# Altium schematic sheet 03_Part-1.SchDoc
size A3; SheetNumber: 3; SheetTotal: 5
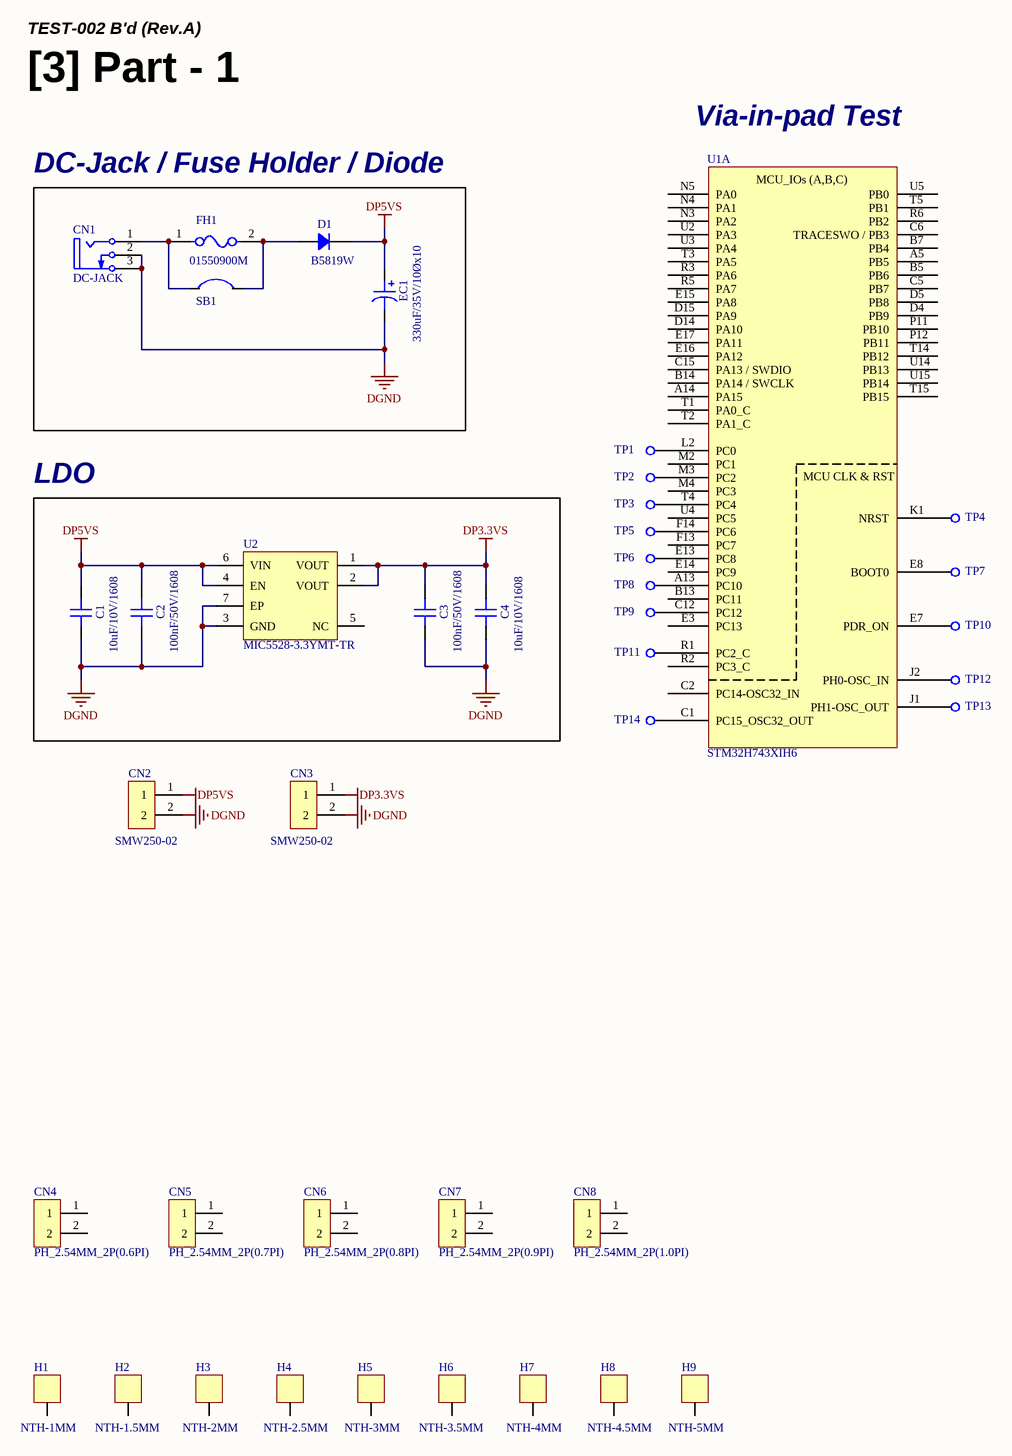
[diagram p0: 03_Part-1.SchDoc]

## Parts
C1  10uF/10V/1608  [CAP 1608 (0603_INCH)]
C2  100nF/50V/1608  [CAP 1608 (0603_INCH)]
C3  100nF/50V/1608  [CAP 1608 (0603_INCH)]
C4  10uF/10V/1608  [CAP 1608 (0603_INCH)]
CN1  DC-JACK  [DUT_CON_DC-JACK]
CN2  SMW250-02  [CON_SMW250-02]
CN3  SMW250-02  [CON_SMW250-02]
CN4  PH_2.54MM_2P(0.6PI)  [DUT_CON_PIN_HEADER-2PIN(2.54MM)_0.6PI]
CN5  PH_2.54MM_2P(0.7PI)  [DUT_CON_PIN_HEADER-2PIN(2.54MM)_0.7PI]
CN6  PH_2.54MM_2P(0.8PI)  [DUT_CON_PIN_HEADER-2PIN(2.54MM)_0.8PI]
CN7  PH_2.54MM_2P(0.9PI)  [DUT_CON_PIN_HEADER-2PIN(2.54MM)_0.9PI]
CN8  PH_2.54MM_2P(1.0PI)  [DUT_CON_PIN_HEADER-2PIN(2.54MM)_1.0PI]
D1  B5819W  [DIO_SOD-123]
EC1  330uF/35V/10Øx10  [CAP_EC_D10.3MM_H10.5MM]
FH1  01550900M  [FUSE 01550900M_SMD]
H1  NTH-1MM  [DUT_HOLE_NTH-1.0MM]
H2  NTH-1.5MM  [DUT_HOLE_NTH-1.5MM]
H3  NTH-2MM  [DUT_HOLE_NTH-2.0MM]
H4  NTH-2.5MM  [DUT_HOLE_NTH-2.5MM]
H5  NTH-3MM  [DUT_HOLE_NTH-3.0MM]
H6  NTH-3.5MM  [DUT_HOLE_NTH-3.5MM]
H7  NTH-4MM  [DUT_HOLE_NTH-4.0MM]
H8  NTH-4.5MM  [DUT_HOLE_NTH-4.5MM]
H9  NTH-5MM  [DUT_HOLE_NTH-5.0MM]
SB1  SB  [DUT_SB_Solder-Bridge]  (value not drawn)
TP1  TP_CIRCLE  [TP Circle]  (value not drawn)
TP2  TP_CIRCLE  [TP Circle]  (value not drawn)
TP3  TP_CIRCLE  [TP Circle]  (value not drawn)
TP4  TP_CIRCLE  [TP Circle]  (value not drawn)
TP5  TP_CIRCLE  [TP Circle]  (value not drawn)
TP6  TP_CIRCLE  [TP Circle]  (value not drawn)
TP7  TP_CIRCLE  [TP Circle]  (value not drawn)
TP8  TP_CIRCLE  [TP Circle]  (value not drawn)
TP9  TP_CIRCLE  [TP Circle]  (value not drawn)
TP10  TP_CIRCLE  [TP Circle]  (value not drawn)
TP11  TP_CIRCLE  [TP Circle]  (value not drawn)
TP12  TP_CIRCLE  [TP Circle]  (value not drawn)
TP13  TP_CIRCLE  [TP Circle]  (value not drawn)
TP14  TP_CIRCLE  [TP Circle]  (value not drawn)
U1  STM32H743XIH6  [IC TFBGA-265]  (part A of 4)
U2  MIC5528-3.3YMT-TR  [IC_TDFN-6]

## Blocks framed on the sheet
DC-Jack / Fuse Holder / Diode: CN1 D1 EC1 FH1 SB1
LDO: C1-C4 U2

## Nets
DGND: C1.1 C2.1 C3.1 C4.1 CN1.2(GND) CN1.3(GND) CN2.2 CN3.2 EC1.2 U2.3(GND) U2.7(EP)
DP3.3VS: C3.2 C4.2 CN3.1 U2.1(VOUT) U2.2(VOUT)
DP5VS: C1.2 C2.2 CN2.1 D1.2 EC1.1 U2.4(EN) U2.6(VIN)
NetCN1_1: CN1.1(VCC) FH1.1 SB1.1
NetD1_1: D1.1 FH1.2 SB1.2
NetTP1_1: TP1.1(TP) U1.L2(PC0)
NetTP2_1: TP2.1(TP) U1.M3(PC2)
NetTP3_1: TP3.1(TP) U1.T4(PC4)
NetTP4_1: TP4.1(TP) U1.K1(NRST)
NetTP5_1: TP5.1(TP) U1.F14(PC6)
NetTP6_1: TP6.1(TP) U1.E13(PC8)
NetTP7_1: TP7.1(TP) U1.E8(BOOT0)
NetTP8_1: TP8.1(TP) U1.A13(PC10)
NetTP9_1: TP9.1(TP) U1.C12(PC12)
NetTP10_1: TP10.1(TP) U1.E7(PDR_ON)
NetTP11_1: TP11.1(TP) U1.R1(PC2_C)
NetTP12_1: TP12.1(TP) U1.J2(PH0-OSC_IN)
NetTP13_1: TP13.1(TP) U1.J1(PH1-OSC_OUT)
NetTP14_1: TP14.1(TP) U1.C1(PC15_OSC32_OUT)

Not connected (* = marked no-connect by the designer): CN4 1 2; CN5 1 2; CN6 1 2; CN7 1 2; CN8 1 2; H1 1; H2 1; H3 1; H4 1; H5 1; H6 1; H7 1; H8 1; H9 1; U1 A5(PB5) A14(PA15) B5(PB6) B7(PB4) B13(PC11) B14(PA14_/_SWCLK) C2(PC14-OSC32_IN) C5(PB7) C6(TRACESWO_/_PB3) C15(PA13_/_SWDIO) D4(PB9) D5(PB8) D14(PA10) D15(PA9) E3(PC13) E14(PC9) E15(PA8) E16(PA12) E17(PA11) F13(PC7) M2(PC1) M4(PC3) N3(PA2) N4(PA1) N5(PA0) P11(PB10) P12(PB11) R2(PC3_C) R3(PA6) R5(PA7) R6(PB2) T1(PA0_C) T2(PA1_C) T3(PA5) T5(PB1) T14(PB12) T15(PB15) U2(PA3) U3(PA4) U4(PC5) U5(PB0) U14(PB13) U15(PB14); U2 5(NC)

## Notes on the sheet
- TEST-002 B'd (Rev.A)
- [3] Part - 1
- Via-in-pad Test
- Title
- Rev
- Doc
- Sheet #
- of
- Author
- This document is copyright of ArkX and shall not be revealed, produced, copied, in whole or in part,
- Date
- nor used for any purpose other than submitted.
- (in symbol IC_MCU_STM32H743XIH6, part A) MCU_IOs (A,B,C); MCU CLK & RST

## Library data of the parts
C1 C4 = CAP_10uF/10V/1608: Ceramic CAP_10uF/10V/1608; LCSC Part #: C19702; JLCPCB Part Type: Basic Part
C2 C3 = CAP_100nF/50V/1608: Ceramic CAP_100nF/50V/1608; LCSC Part #: C14663; JLCPCB Part Type: Basic Part
CN1 = DUT_CON_DC-Jack: DC Power Jack; ComponentLink1Description: Manufacturer Link; ComponentLink1URL: http://www.cliffuk.co.uk/
CN2 CN3 = CON_SMW250-02: YEONHO 2.5mm Pitch Vertical Connector 2Pin
CN4 = DUT_PIN-HEADER_2.54MM_2P(0.6PI)
CN5 = DUT_PIN-HEADER_2.54MM_2P(0.7PI)
CN6 = DUT_PIN-HEADER_2.54MM_2P(0.8PI)
CN7 = DUT_PIN-HEADER_2.54MM_2P(0.9PI)
CN8 = DUT_PIN-HEADER_2.54MM_2P(1.0PI)
D1 = DIO_B5819W: 40V 600mV@1A 1A SOD-123  Schottky Barrier Diodes (SBD) ROHS; LCSC Part #: C8598; JLCPCB Part Type: Basic Part
EC1 = CAP_EC 330uF/35V/10Øx10: Electrolytic CAP_330uF/35V/10Øx10; LCSC Part #: C311621; JLCPCB Part Type: Extended Part
FH1 = FUSE_01550900M-SMD: Fuse Block 10A 125V 1 Circuit Cartridge Surface Mount; LCSC Part #: C108518; JLCPCB Part Type: Extended Part
H1 = DUT_HOLE_NTH-1.0MM: Non-Through Hole 1mm
H2 = DUT_HOLE_NTH-1.5MM: Non-Through Hole 1.5mm
H3 = DUT_HOLE_NTH-2.0MM: Non-Through Hole 2mm
H4 = DUT_HOLE_NTH-2.5MM: Non-Through Hole 2.5mm
H5 = DUT_HOLE_NTH-3.0MM: Non-Through Hole 3mm
H6 = DUT_HOLE_NTH-3.5MM: Non-Through Hole 3.5mm
H7 = DUT_HOLE_NTH-4.0MM: Non-Through Hole 4mm
H8 = DUT_HOLE_NTH-4.5MM: Non-Through Hole 4.5mm
H9 = DUT_HOLE_NTH-5.0MM: Non-Through Hole 5mm
SB1 = DUT_SB_Solder-Bridge: SB_Solder-Bridge
U1 = IC_MCU_STM32H743XIH6: ARM® Cortex®-M7 STM32H7 MCU IC 32bit Single-core 480MHz 2MB(2M x 8) Flash 240+25-TFBGA(14x14); LCSC Part #: C114407; JLCPCB Part Type: Extended Part
U2 = IC_REG_MIC5528-3.3YMT-TR: Linear Voltage Regulator IC Positive Fixed 1 Output 500mA 6-TDFN (1.2x1.2); LCSC Part #: C622490; JLCPCB Part Type: Extended Part